# EAGLE design MySens-GWeasySensRS485-V03-062 (EAGLE 9.5.0)
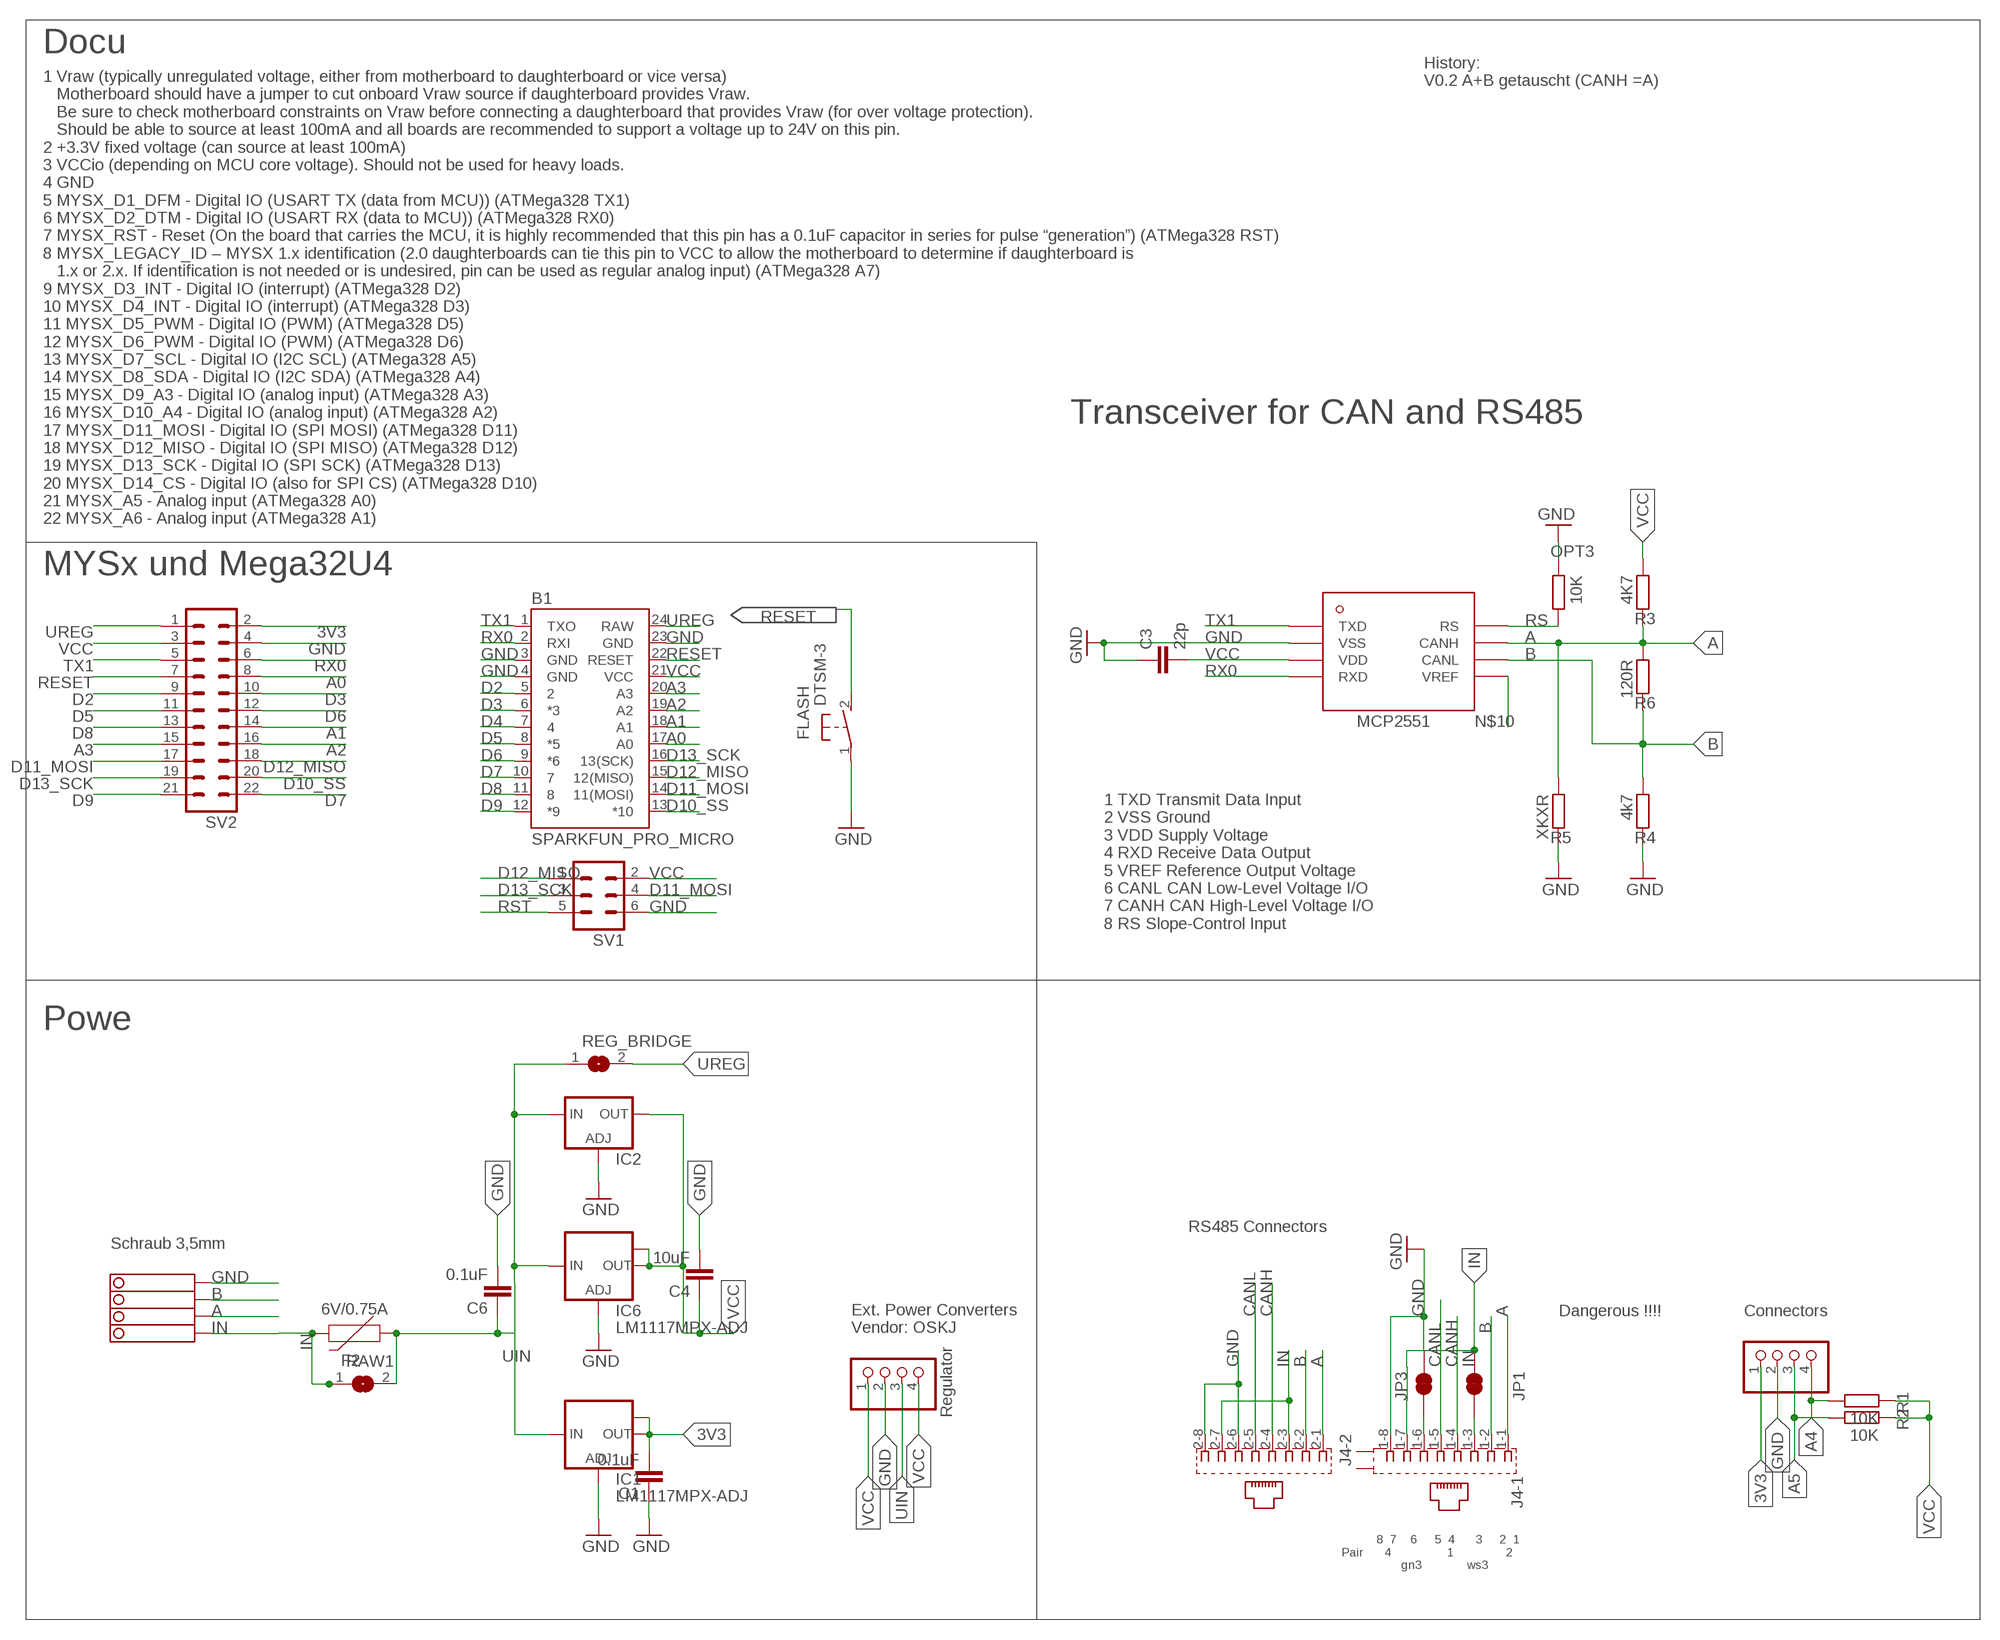
[diagram p0: schematic, sheet 1]

## Parts
B1  SPARKFUN_PRO_MICRO  [SPARKFUN_PRO_MICRO]
C1  0.1uF  C-EUC1206  [C1206]
C3  22p  C-EUC0805  [C0805]
C4  10uF  C-EUC1210  [C1210]
C6  0.1uF  C-EUC1206  [C1206]
F2  6V/0.75A  PPTC_THREE-QUARTER-AMP  [1206]
FLASH  DTSM-3  [DTSM-3]
I2C  PINHD-1X04_2.54-S  [1X04-S]
IC1  LM1117MPX-ADJ  [SOT223]
IC2  LD117ADT50TR  [DPACK]
IC6  LM1117MPX-ADJ  [SOT223]
J4  RJ45_2X_S  [RJ45_2X_S]
JP1  JUMPER-SMT_2_NC_TRACE_SILK  [SMT-JUMPER_2_NC_TRACE_SILK]
JP3  JUMPER-SMT_2_NC_TRACE_SILK  [SMT-JUMPER_2_NC_TRACE_SILK]
OPT3  10K  R-EU_R0805  [R0805]
R1  10K  R-EU_R0805  [R0805]
R2  10K  R-EU_R0805  [R0805]
R3  4K7  R-EU_R0805  [R0805]
R4  4k7  R-EU_R0805  [R0805]
R5  XKXR  R-EU_R0805  [R0805]
R6  120R  R-EU_R0805  [R0805]
RAW1  SJ  [SJ]
REG_BRIDGE  SJ  [SJ]
STEPDWN  PINHD-1X04_2.54-S  [1X04-S]
SV1  MA03-2  [MA03-2]
SV2  MA11-2  [MA11-2]
U$1  MCP2551  [SOIC-8]
X4  1751264  [1751264]

## Nets
1: J4.1-3 JP1.1
2: J4.1-6 JP3.1
3V3: C1.2 I2C.1 IC1.2(OUT) IC1.TAB(OUT1) SV2.2
A: J4.1-1 J4.2-1 R3.2 R5.1 R6.1 U$1.CANH X4.2
A0: B1.17(A0) SV2.8
A1: B1.18(A1) SV2.14
A2: B1.19(A2) SV2.16
A3: B1.20(A3) SV2.15
A4: I2C.4 R1.2
A5: I2C.3 R2.2
B: J4.1-2 J4.2-2 R4.1 R6.2 U$1.CANL X4.3
CANH: J4.1-4 J4.2-4
CANL: J4.1-5 J4.2-5
D2: B1.5 SV2.9
D3: B1.6(*3) SV2.10
D4: B1.7
D5: B1.8(*5) SV2.11
D6: B1.9(*6) SV2.12
D7: B1.10 SV2.22
D8: B1.11 SV2.13
D9: B1.12(*9) SV2.21
D10_SS: B1.13(*10) SV2.20
D11_MOSI: B1.14(11(MOSI)) SV1.4 SV2.17
D12_MISO: B1.15(12(MISO)) SV1.1 SV2.18
D13_SCK: B1.16(13(SCK)) SV1.3 SV2.19
GND [Power]: B1.3(GND) B1.4(GND) B1.23(GND) C1.1 C3.1 C4.2 C6.2 FLASH.1 I2C.2 IC1.1(ADJ) IC2.1(ADJ) IC6.1(ADJ) J4.1-8 J4.2-6 J4.2-8 JP3.2 OPT3.1 R4.2 R5.2 STEPDWN.2 SV1.6 SV2.4 U$1.VSS X4.4
IN [Power]: F2.2 J4.1-7 J4.2-3 J4.2-7 JP1.2 RAW1.1 X4.1
N$10: U$1.VREF
RESET: B1.22(RESET) FLASH.2 SV2.7
RS: OPT3.2 U$1.RS
RST: SV1.5
RX0: B1.2(RXI) SV2.6 U$1.RXD
TX1: B1.1(TXO) SV2.5 U$1.TXD
UIN [Power]: C6.1 F2.1 IC1.3(IN) IC2.3(IN) IC6.3(IN) RAW1.2 REG_BRIDGE.1 STEPDWN.3
UREG [Power]: B1.24(RAW) REG_BRIDGE.2 SV2.1
VCC [Power]: B1.21(VCC) C3.2 C4.1 IC2.4(OUT) IC6.2(OUT) IC6.TAB(OUT1) R1.1 R2.1 R3.1 STEPDWN.1 STEPDWN.4 SV1.2 SV2.3 U$1.VDD
Unconnected: J4.G1(-1:S2) J4.G3(-1:S1)

## Notes on the sheet
- Docu
- History:
  V0.2 A+B getauscht (CANH =A)
- Transceiver for CAN and RS485
- 1 Vraw (typically unregulated voltage, either from motherboard to daughterboard or vice versa)
     Motherboard should have a jumper to cut onboard Vraw source if daughterboard provides Vraw. 
     Be sure to check motherboard constraints on Vraw before connecting a daughterboard that provides Vraw (for over voltage protection). 
     Should be able to source at least 100mA and all boards are recommended to support a voltage up to 24V on this pin.
  2 +3.3V fixed voltage (can source at least 100mA)
  3 VCCio (depending on MCU core voltage). Should not be used for heavy loads.
  4 GND
  5 MYSX_D1_DFM - Digital IO (USART TX (data from MCU)) (ATMega328 TX1)
  6 MYSX_D2_DTM - Digital IO (USART RX (data to MCU)) (ATMega328 RX0)
  7 MYSX_RST - Reset (On the board that carries the MCU, it is highly recommended that this pin has a 0.1uF capacitor in series for pulse “generation”) (ATMega328 RST)
  8 MYSX_LEGACY_ID – MYSX 1.x identification (2.0 daughterboards can tie this pin to VCC to allow the motherboard to determine if daughterboard is 
     1.x or 2.x. If identification is not needed or is undesired, pin can be used as regular analog input) (ATMega328 A7)
  9 MYSX_D3_INT - Digital IO (interrupt) (ATMega328 D2)
  10 MYSX_D4_INT - Digital IO (interrupt) (ATMega328 D3)
  11 MYSX_D5_PWM - Digital IO (PWM) (ATMega328 D5)
  12 MYSX_D6_PWM - Digital IO (PWM) (ATMega328 D6)
  13 MYSX_D7_SCL - Digital IO (I2C SCL) (ATMega328 A5)
  14 MYSX_D8_SDA - Digital IO (I2C SDA) (ATMega328 A4)
  15 MYSX_D9_A3 - Digital IO (analog input) (ATMega328 A3)
  16 MYSX_D10_A4 - Digital IO (analog input) (ATMega328 A2)
  17 MYSX_D11_MOSI - Digital IO (SPI MOSI) (ATMega328 D11)
  18 MYSX_D12_MISO - Digital IO (SPI MISO) (ATMega328 D12)
  19 MYSX_D13_SCK - Digital IO (SPI SCK) (ATMega328 D13)
  20 MYSX_D14_CS - Digital IO (also for SPI CS) (ATMega328 D10)
  21 MYSX_A5 - Analog input (ATMega328 A0)
  22 MYSX_A6 - Analog input (ATMega328 A1)
- MYSx und Mega32U4
- 1 TXD Transmit Data Input 
  2 VSS Ground 
  3 VDD Supply Voltage 
  4 RXD Receive Data Output 
  5 VREF Reference Output Voltage 
  6 CANL CAN Low-Level Voltage I/O 
  7 CANH CAN High-Level Voltage I/O 
  8 RS Slope-Control Input
- Powe
- RS485 Connectors
- Schraub 3,5mm
- Dangerous !!!! | Connectors
- Ext. Power Converters
  Vendor: OSKJ
- Regulator
- 8  7    6     5  4      3     2  1
  Pair      4                1               2
                   gn3             ws3

## Library data of the parts
B1 = SparkFun-Boards:SPARKFUN_PRO_MICRO: SparkFun Pro Micro Atmega32U4 compatible footprint. SparkFun Products: 3.3V/8MHz <https://www.sparkfun.com/products/12587> 5V/16MHz <https://www.sparkfun.com/products/12640>
C1 C3 C4 C6 = rcl:C-EU: CAPACITOR, European symbol
F2 = SparkFun-Fuses:PPTC: Resettable Fuse PPTC Resettable Fuse. Really a sort of resistor with a polymeric positive temperature coefficient whose resistance increases dramatically with an increase in temperature. When heated by the power passing through the resistance rises causing the current to be limited, protecting the circuit. This is achieved by the transition of the polymer from a crystalline to an amorphous state where the conductive carbon separates breaking the conductive pathways found in the cool crystalline structure. When a PPTC cools back down it resumes conducting letting the circuit turn back on. SparkFun Products: SparkFun RedBoard - Programmed with Arduino <https://www.sparkfun.com/products/12757> Pro Micro - 5V/16MHz <https://www.sparkfun.com/products/12640> Arduino Pro 328 - 5V/16MHz <https://www.sparkfun.com/products/10915> MP3 Trigger <https://www.sparkfun.com/products/13720>; PROD_ID: RES-11150
FLASH = mechanics:DTSM-3: Diptronics SMD button 6x3.5 mm
I2C STEPDWN = pinhead-2:PINHD-1X04: PIN HEADER
IC1 IC6 = lm1117:LM1117MPX-ADJ
IC2 = v-reg:LD117A?*: Low drop fixed and adjustable positive voltage regulators 1 A Source: http://www.st.com/stonline/products/literature/ds/7194/ld1117axx.pdf
J4 = RJ45:RJ45_2X_S: AMP connector
JP1 JP3 = SparkFun-Jumpers:JUMPER-SMT_2_NC_TRACE: Normally closed trace jumper This jumper has a trace between two pads so it's normally closed (NC). Use a razor knife to open the connection. For best results follow the IPC guidelines for cutting traces: Cutout at least 0.063 mm (0.005 in). Remove all loose material to clean up the cut area. Seal the cut with an approved epoxy. Reapply solder to reclose the connection.
OPT3 R1-R6 = rcl:R-EU_: RESISTOR, European symbol
RAW1 REG_BRIDGE = jumper:SJ: SMD solder JUMPER
SV1 = con-lstb:MA03-2: PIN HEADER; OC_FARNELL: unknown; OC_NEWARK: unknown
SV2 = con-Pinheader:MA11-2: PIN HEADER; OC_FARNELL: unknown; OC_NEWARK: unknown
U$1 = MCP2551:MCP2551: The MCP2551 is a high-speed CAN, fault-tolerant device that serves as the interface between a CAN protocol controller and the physical bus. The MCP2551 provides differential transmit and receive capability for the CAN protocol controller and is fully compatible with the ISO-11898 standard, including 24V requirements. It will operate at speeds of up to 1 Mb/s. Typically, each node in a CAN system must have a device to convert the digital signals generated by a CAN controller to signals suitable for transmission over the bus cabling (differential output). It also provides a buffer between the CAN controller and the high-voltage spikes that can be generated on the CAN bus by outside sources (EMI, ESD, electrical transients, etc.).
X4 = con-phoenix-350:1751264: MKDS 1/ 4-3,5 Printklemme Nennstrom: 10 A Bemessungsspannung: 160 V Raster: 3,5 mm Polzahl: 4 Montageart: Löten Anschlussart: Schraubanschluss Anschlussrichtung vom Leiter zur Platine: 0° Source: http://eshop.phoenixcontact.com .. 1751264.pdf; MPN: 1751264; OC_FARNELL: unknown; OC_NEWARK: 10R0934

## Net classes
0 default: width 0.254 mm
1 Power: width 0.508 mm

## Board
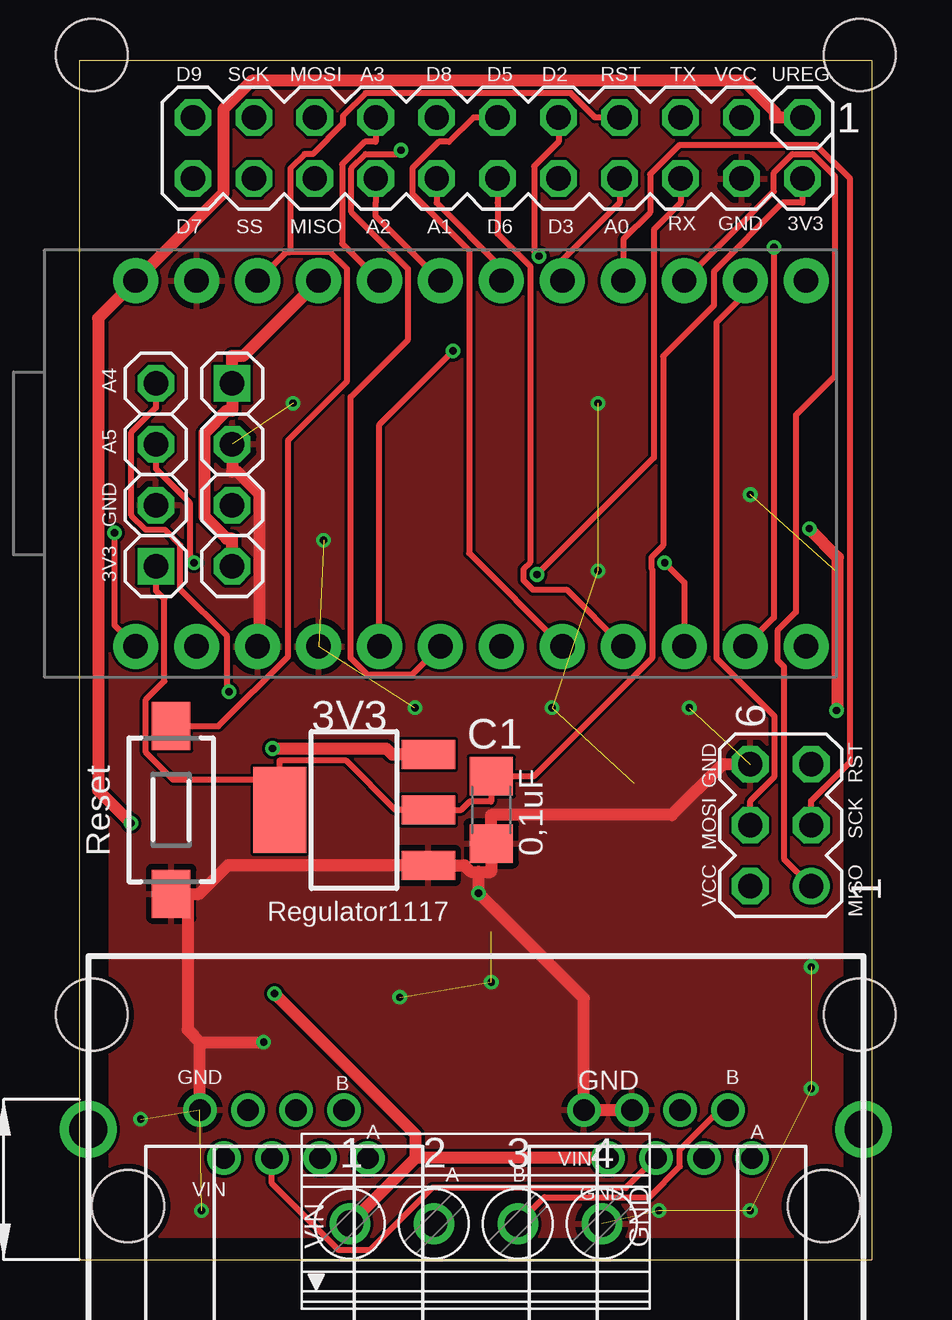
[diagram p1: board, top side]
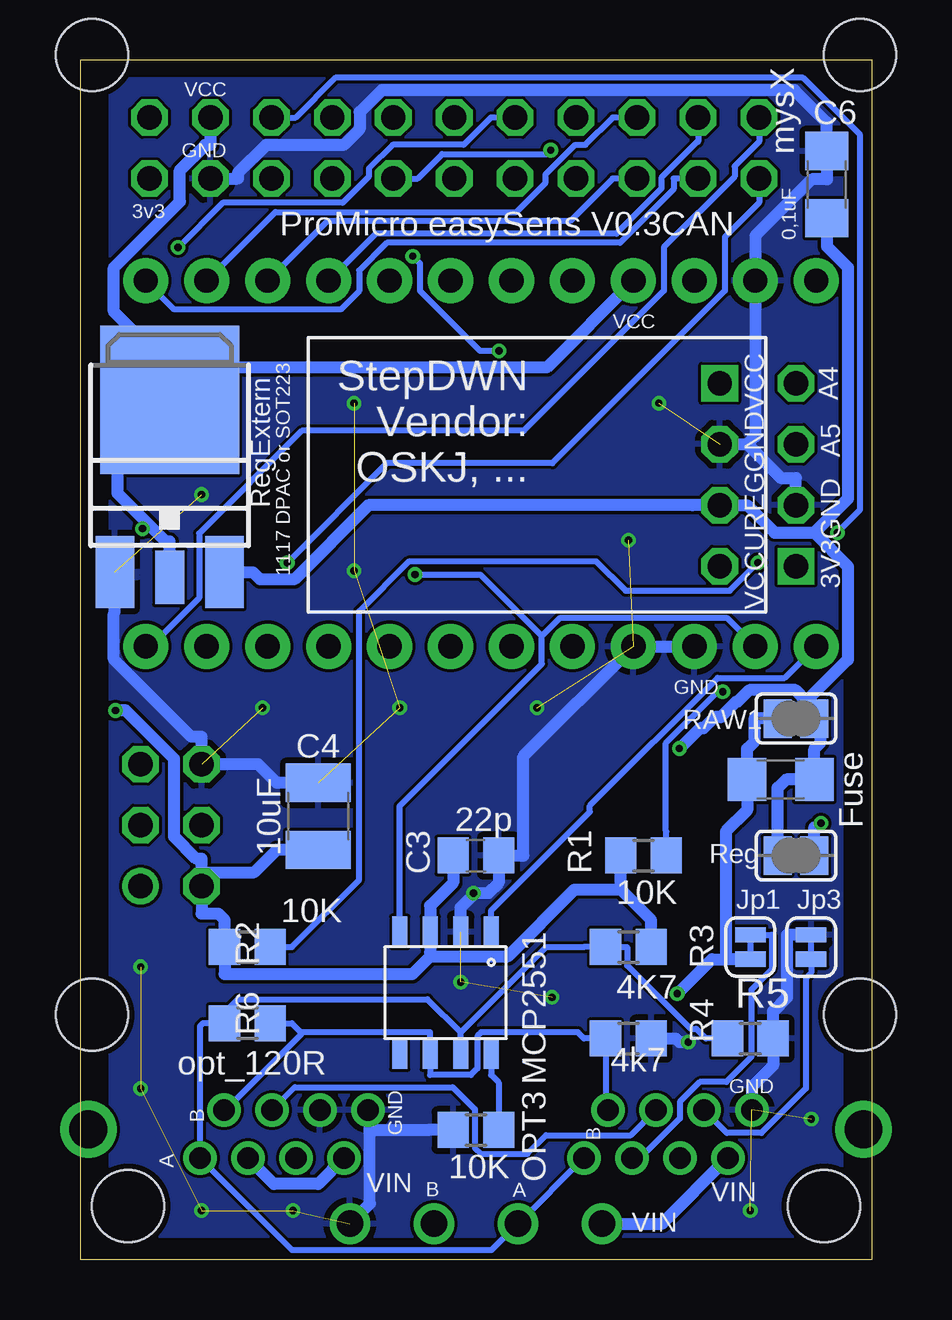
[diagram p2: board, bottom side, seen from below]

Size 33 x 50 mm. Coordinates in mm from the lower left corner, seen from the top.
Outline: 0,0 0,50 33,50 33,0 0,0
Copper layers (1*16): Top 0.035mm / dielectric 1.5mm / Bottom 0.035mm
Design rules "dirt_cheap_dirty_boards.v1": minimum track width 5mil, minimum drill 12mil, track to track 5mil, track to pad 5mil, pad to pad 5mil, via to via 5mil, smd to smd 0mil, copper to edge 10mil, drill to drill 10mil, minimum pad ring 10mil, minimum via ring 6mil, stop-mask expansion 2mil, vias tented up to drill 25mil, thermal gap 10mil
Holes 3 mm at 32.5,50.2 0.5,50.2 32.5,10.2 0.5,10.2
tRestrict: area 0,50 to 33,50.5; area 32.8,11.9 to 33.3,44.9
bRestrict: area 0,50 to 33,50.5; area 32.8,12 to 33.3,45

### Footprints (pad centres in the part's own frame; a part is rotated, then mirrored left to right if it is on the bottom)
SPARKFUN_PRO_MICRO = drill 1.016 pad 1.88: 1 -7.62,12.7; 2 -7.62,10.16; 3 -7.62,7.62; 4 -7.62,5.08; 5 -7.62,2.54; 6 -7.62,0; 7 -7.62,-2.54; 8 -7.62,-5.08; 9 -7.62,-7.62; 10 -7.62,-10.16; 11 -7.62,-12.7; 12 -7.62,-15.24; 13 7.62,-15.24; 14 7.62,-12.7; 15 7.62,-10.16; 16 7.62,-7.62; 17 7.62,-5.08; 18 7.62,-2.54; 19 7.62,0; 20 7.62,2.54; 21 7.62,5.08; 22 7.62,7.62; 23 7.62,10.16; 24 7.62,12.7
C1206 = smd 1.6 x 1.8: 1 -1.4,0; 2 1.4,0
C0805 = smd 1.3 x 1.5: 1 -0.95,0; 2 0.95,0
C1210 = smd 1.6 x 2.7: 1 -1.4,0; 2 1.4,0
1206 = smd 1.6 x 1.8: 1 -1.4,0; 2 1.4,0
DTSM-3 = smd 2 x 1.6: 1 -3.494,0; 2 3.494,0
1X04-S = drill 1.016 square: 1 -3.81,0 | drill 1.016 octagon: 2 -1.27,0; 3 1.27,0; 4 3.81,0
SOT223 = smd 1.219 x 2.235: 1 -2.311,-3.099; 2 0,-3.099; 3 2.311,-3.099 | smd 3.6 x 2.2: TAB 0,3.099
DPACK = smd 1.6 x 3: 1 -2.28,-4.8; 3 2.28,-4.8 | smd 5.8 x 6.2: 4 0,2.38
RJ45_2X_S = drill 0.889: 1-1 -4.5,2; 1-2 -5.5,4; 1-3 -6.5,2; 1-4 -7.5,4; 1-5 -8.5,2; 1-6 -9.5,4; 1-7 -10.5,2; 1-8 -11.5,4; 2-1 11.5,2; 2-2 10.5,4; 2-3 9.5,2; 2-4 8.5,4; 2-5 7.5,2; 2-6 6.5,4; 2-7 5.5,2; 2-8 4.5,4 | drill 1.575 pad 2.184: G1 -16.15,3.2; G3 16.15,3.2 | hole 3: -14.5,0; 14.5,0
SMT-JUMPER_2_NC_TRACE_SILK = smd 0.635 x 1.27: 1 -0.508,0; 2 0.508,0
R0805 = smd 1.3 x 1.5: 1 -0.95,0; 2 0.95,0
SJ = smd 1.168 x 1.6: 1 -0.762,0; 2 0.762,0
MA03-2 = drill 1.016: 1 -2.54,-1.27 | drill 1.016 octagon: 2 -2.54,1.27; 3 0,-1.27; 4 0,1.27; 5 2.54,-1.27; 6 2.54,1.27
MA11-2 = drill 1.016 octagon: 1 -12.7,-1.27; 2 -12.7,1.27; 3 -10.16,-1.27; 4 -10.16,1.27; 5 -7.62,-1.27; 6 -7.62,1.27; 7 -5.08,-1.27; 8 -5.08,1.27; 9 -2.54,-1.27; 10 -2.54,1.27; 11 0,-1.27; 12 0,1.27; 13 2.54,-1.27; 14 2.54,1.27; 15 5.08,-1.27; 16 5.08,1.27; 17 7.62,-1.27; 18 7.62,1.27; 19 10.16,-1.27; 20 10.16,1.27; 21 12.7,-1.27; 22 12.7,1.27
SOIC-8 = smd 1.27 x 0.635: CANH 2.54,0.635; CANL 2.54,-0.635; RS 2.54,1.905; RXD -2.54,-1.905; TXD -2.54,1.905; VDD -2.54,-0.635; VREF 2.54,-1.905; VSS -2.54,0.635
1751264 = drill 1.1 pad 1.7: 1 -5.25,-0.1; 2 -1.75,-0.1; 3 1.75,-0.1; 4 5.25,-0.1

### Placement (x,y rotation side)
B1  15.03,33.18 90 top
C1  17.14,18.74 90 top
C3  16.51,16.84 180 bottom
C4  23.08,18.48 90 bottom
C6  1.89,44.81 90 bottom
F2  3.81,20.01 180 bottom
FLASH  3.81,18.74 90 top
I2C  3.17,32.71 90 top
IC1  11.43,18.74 90 top
IC2  29.27,33.46 0 bottom
IC6  29.27,31.53 0 bottom
J4  16.51,2.23 0 top
JP1  5.08,13.03 270 bottom
JP3  2.54,13.03 90 bottom
OPT3  16.51,5.41 0 bottom
R1  9.53,16.84 0 bottom
R2  26.04,13.03 0 bottom
R3  10.16,13.03 180 bottom
R4  10.16,9.21 0 bottom
R5  5.08,9.21 0 bottom
R6  26.04,9.85 0 bottom
RAW1  3.17,22.55 0 bottom
REG_BRIDGE  3.17,16.84 0 bottom
STEPDWN  6.35,32.71 270 top
SV1  29.21,18.11 90 top
SV2  17.41,46.33 180 top
U$1  17.78,11.12 270 bottom
X4  16.51,1.6 0 top

### Tracks (layer width: path | path; a pad name or v marks a point on that pad's centre or on a via)
1
  Bottom 0.254: JP1.1 4.19,13.53 4.19,12.09 5.03,11.25 5.03,8.45 6.08,7.41 7.18,7.41 8.01,6.58 8.01,5.88 9.66,4.23 J4.1-3
2
  Bottom 0.254: JP3.1 2.54,11.95 2.76,11.72 2.76,7.13 4.62,5.27 6.05,5.27 J4.1-6
3V3
  Top 0.254: SV2.2 30.11,44.04 29.28,44.04 26.42,41.19 26.42,39.76 24.31,37.65 24.31,29.77 23.82,29.27 23.82,28.8 23.85,28.77 23.85,25.06 18.93,20.14 C1.2 17.14,19.09 16.25,19.09 15.9,18.74 IC1.2 13.16,18.74 11.1,20.79 8.33,20.79 8.33,19.99 | I2C.1 3.17,27.88 3.53,27.53 3.53,24.11 2.76,23.34 2.76,21.13 3.89,19.99 8.33,19.99 | IC1.TAB 8.33,19.99
A
  Bottom 0.254: J4.1-1 14.74,1.5 X4.2 15.87,0.39 24.17,0.39 J4.2-1 28.01,9.73 27.89,9.85 27.44,9.85 | R5.1 6.93,9.21 7.33,9.62 7.56,9.62 10.21,12.26 10.21,13.03 R3.2 12.01,13.03 13.59,13.03 17.14,9.47 | 27.44,9.85 26.43,10.85 18.53,10.85 17.14,9.47 | R6.1 27.44,9.85 | U$1.CANH 17.14,9.47
A0
  Top 0.254: SV2.8 22.5,44.04 20.11,41.66 B1.17
A1
  Top 0.254: SV2.14 14.88,44.04 17.57,41.35 B1.18
A2
  Top 0.254: B1.19 12.34,43.49 12.34,44.04 SV2.16
A3
  Top 0.254: SV2.15 12.34,46.58 11.88,46.58 10.94,45.65 10.94,42.35 B1.20
A4  (via drill 0.3 pad 0.61)
  Top 0.254: v6.23,23.67 6.14,23.75 6.14,25.98 4.2,27.92 4.2,29.76 3.55,30.41 2.76,30.41 2.16,31.01 2.16,34.49 3.17,35.5 I2C.4
  Bottom 0.254: v6.23,23.67 6.46,23.67 8.6,21.53 8.6,17.86 8.57,17.84 R1.2
A5  (via drill 0.3 pad 0.61)
  Top 0.254: v4.76,29.05 4.58,29.23 4.58,31.56 3.17,32.96 I2C.3
  Bottom 0.254: v4.76,29.05 5.93,27.88 10.28,27.88 11.51,29.11 19.28,29.11 21.38,27.01 21.38,15.83 24.18,13.03 R2.2
B
  Top 0.254: X4.3 19.36,2.6 23.73,2.6 25.01,3.88 25.01,4.58 26.66,6.23 J4.2-2
  Bottom 0.254: J4.1-2 11.11,6.33 R4.1 12.01,9.21 12.27,9.47 16.3,9.47 16.45,9.32 16.45,7.96 16.72,7.69 18.41,7.69 U$1.CANL 18.41,8.93 18.41,9.47 23.8,9.47 | 23.8,9.47 24.18,9.85 R6.2 | 23.8,9.47 23.8,9.37 26.94,6.23 J4.2-2
CANH
  Bottom 0.254: J4.2-4 24.06,7.18 17.48,7.18 16.56,6.26 16.56,4.64 16.32,4.4 14.37,4.4 13.59,5.18 10.06,5.18 J4.1-4
CANL
  Top 0.254: J4.2-5 22.76,2.98 14.68,2.98 12.09,0.39 10.8,0.39 8.01,3.18 J4.1-5
D2  (via drill 0.3 pad 0.61)
  Top 0.254: v19.14,41.82 18.94,42.03 18.94,45.57 19.95,46.58 SV2.9 | B1.5 12.49,34.81 v15.55,37.87
  Bottom 0.254: v15.55,37.87 16.34,37.87 18.84,40.37 18.84,41.52 v19.14,41.82
D3  (via drill 0.3 pad 0.61)
  Top 0.254: B1.6 13.84,24.37 11.99,24.37 11.29,25.07 11.29,35.96 13.69,38.35 13.69,41.29 11.32,43.66 11.32,45.48 11.91,46.08 13.23,46.08 v13.39,46.24
  Bottom 0.254: v13.39,46.24 13.55,46.08 17.92,46.08 18.94,45.06 SV2.10
D5
  Top 0.254: B1.8 16.23,29.44 16.23,42.06 13.86,44.42 13.86,45.48 14.96,46.58 15.38,46.58 16.4,47.6 SV2.11
D6
  Top 0.254: B1.9 20.29,27.92 18.89,27.92 18.48,28.32 18.48,28.78 18.76,29.06 18.76,41.41 17.41,42.76 17.41,44.04 SV2.12
D7  (via drill 0.3 pad 0.61)
  Top 0.254: v24.37,29.04 25.19,28.22 B1.10
  Bottom 0.254: SV2.22 4.71,44.04 6.14,42.62 6.14,40.38 13.32,33.19 20.22,33.19 v24.37,29.04
D8  (via drill 0.3 pad 0.61)
  Top 0.254: v28.92,42.18 28.92,26.75 B1.11
  Bottom 0.254: v28.92,42.18 27.06,44.04 22.07,44.04 20.97,45.14 20.97,45.48 19.98,46.47 17.02,46.47 15.89,47.6 SV2.13
D9
  Bottom 0.254: SV2.21 4.71,46.58 5.73,45.57 5.73,45.14 8.68,42.19 8.68,40.38 14.51,34.55 23.76,34.55 28.05,30.26 28.05,27.57 30.05,25.56 B1.12
D10_SS
  Bottom 0.254: B1.13 29.07,39.6 22.15,39.6 21.38,40.38 21.38,41.22 20.22,42.38 10.5,42.38 8.27,44.61 8.27,45.06 SV2.20
D11_MOSI
  Top 0.254: B1.14 27.73,40.26 26.54,39.07 26.54,25.06 28.96,22.64 28.96,20.14 27.94,19.12 SV1.4
  Bottom 0.254: SV2.17 10.81,47.6 11.95,46.47 12.37,46.47 13.61,45.23 13.61,44.89 14.83,43.66 24.87,43.66 B1.14
D12_MISO
  Top 0.254: B1.15 28.92,44.53 28.92,45.3 29.69,46.08 30.54,46.08 31.46,45.15 31.46,36.83 29.84,35.21 29.84,26.98 29.07,26.21 29.07,24.98 29.34,24.71 29.34,16.7 SV1.1
  Bottom 0.254: SV2.18 10.81,45.06 12.59,43.28 22.71,43.28 B1.15
D13_SCK
  Top 0.254: B1.16 22.65,42.52 23.77,43.64 23.77,45.23 24.99,46.46 30.7,46.46 32.1,45.05 32.1,20.74 30.48,19.12 SV1.3
  Bottom 0.254: B1.16 20.69,42.76 10.66,42.76 8.78,44.64 8.78,45.09 7.29,46.58 7.25,46.58 SV2.19
GND  (via drill 0.3 pad 0.61)  (16 unrouted)
  Top 0.508: SV1.6 26.8,20.64 24.67,18.52 17.14,18.52 C1.1 17.14,16.16 16.61,16.16 | 16.61,16.16 16.3,16.16 16.03,16.43 IC1.1 6.17,16.43 4.99,15.25 4.49,15.25 | 16.61,16.16 v16.61,15.28 21.01,10.88 J4.2-8 J4.2-6 | STEPDWN.2 6.35,32.84 6.57,32.84 7.49,31.92 7.49,25.64 B1.3 | 5.01,9.06 v7.67,9.06 | 4.49,15.25 4.49,9.57 5.01,9.06 | J4.1-8 5.01,9.06 | FLASH.1 4.49,15.25
  Bottom 0.508: 5.21,33.98 4.87,34.32 B1.23 4.87,42.67 2.52,45.02 1.89,45.02 C6.2 1.89,47.39 3.25,48.74 20.43,48.74 21.35,47.83 21.35,47.12 22.02,46.46 25.26,46.46 26.43,45.28 26.43,45.06 SV2.4 | I2C.2 3.17,32.58 3.81,32.58 5.21,33.98 | STEPDWN.2 5.21,33.98 | B1.3 B1.4 14.53,20.98 14.53,16.84 C3.1 15.56,15.7 15.99,15.28 v16.61,15.28 16.61,15.21 17.14,14.68 U$1.VSS | R4.2 8.18,9.21 8.02,9.06 v7.67,9.06 | J4.1-8 5.01,7.2 4.13,8.08 R5.2 4.13,10.35 3.56,10.92 3.56,13.53 JP3.2 | 20.93,5.41 20.93,6.15 J4.2-8 | X4.4 20.93,2.33 20.93,5.41 | 20.93,5.41 18.49,5.41 OPT3.1 | IC2.1 31.55,28.47 IC6.1 31.58,26.94 31.59,26.93 31.59,25.01 28.37,21.79 27.94,21.79 SV1.6 25.58,20.64 24.81,19.88 C4.2
  other vias: 8.89,35.7 10.16,29.98 21.59,28.71 21.59,35.7 27.94,31.88 25.4,23 19.68,23 13.97,23 24.13,2.04 27.94,2.04 30.48,7.12 30.48,12.2 5.08,2.04 2.54,5.85 13.34,10.93 17.14,11.56
  pour Bottom: 1.27,49.22 31.75,49.22 31.75,0.96 1.27,0.96
  pour Top: 1.27,0.96 1.27,49.22 31.75,49.22 31.75,0.96
IN  (via drill 0.3 pad 0.61)
  Top 0.508: 13.99,4.23 X4.1 | J4.2-7 13.99,4.23 | 13.99,4.23 13.99,5.2 v8.12,11.08
  Bottom 0.508: J4.2-7 23.09,3.15 24.93,3.15 J4.2-3 | 6.1,12.52 6.1,17.84 5.21,18.73 F2.2 5.21,20.44 5.21,21.29 4.9,21.6 4.9,22.55 RAW1.1 | v8.12,11.08 6.68,12.52 6.1,12.52 | JP1.2 6.1,12.52 | X4.1 8.74,1.5 J4.1-7
RESET
  Top 0.254: 8.78,42 10.44,42 11.14,41.29 11.14,36.62 8.68,34.15 8.68,25.14 5.78,22.23 4.86,22.23 FLASH.2 | B1.22 8.61,42 8.78,42 | 8.78,42 8.78,45.49 9.37,46.08 9.71,46.08 10.97,47.33 10.97,47.67 11.91,48.62 20.46,48.62 21.48,47.6 SV2.7
RS
  Bottom 0.254: U$1.RS 15.88,7.69 15.56,7.38 OPT3.2
RX0  (via drill 0.3 pad 0.61)
  Top 0.254: SV2.6 25.04,44.04 23.92,42.93 23.92,33.42 v19.05,28.55
  Bottom 0.254: 13.76,25.98 12.99,26.76 6.07,26.76 B1.2 | U$1.RXD 19.68,18.9 13.76,24.82 13.76,25.98 | v19.05,28.55 16.33,28.55 13.76,25.98
TX1  (via drill 0.3 pad 0.61)
  Top 0.254: B1.1 1.45,26.44 v1.45,30.3
  Bottom 0.254: U$1.TXD 15.88,14.55 11.76,18.66 11.76,18.92 6.44,24.24 3.65,24.24 B1.1 | SV2.5 24.02,47.6 22.37,49.25 2.88,49.25 0.5,46.88 0.5,31.25 v1.45,30.3
UIN  (via drill 0.3 pad 0.61)
  Top 0.508: v8.04,21.3 12.78,21.3 13.03,21.05 IC1.3
  Bottom 0.508: 2.74,23.28 3.19,23.73 5.12,23.73 5.6,23.25 5.67,23.25 6.31,22.61 6.56,22.61 7.02,22.15 7.16,22.15 8.01,21.3 v8.04,21.3 | 2.42,30.3 4.06,30.3 5.21,31.44 STEPDWN.3 7.49,31.44 21,31.44 24.09,28.35 25.51,28.35 25.81,28.66 IC2.3 26.99,28.47 IC6.3 | REG_BRIDGE.1 3.94,19.66 3.59,20.01 F2.1 2.41,21.29 2.17,21.53 2.17,22.55 | 2.74,23.28 2.17,22.71 2.17,22.55 | 2.42,30.3 1.01,28.88 1.01,25.01 2.74,23.28 | 2.42,30.3 1.01,31.71 1.01,41.36 1.88,42.23 1.89,42.23 C6.1 | RAW1.2 2.17,22.55
UREG  (via drill 0.3 pad 0.61)
  Top 0.508: SV2.1 28.97,47.6 28.97,47.82 27.67,49.13 7.17,49.13 5.99,47.95 5.99,44.45 B1.24 0.77,39.24 0.77,19.56 v2.13,18.19
  Bottom 0.508: v2.13,18.19 2.31,18.02 2.41,18.02 REG_BRIDGE.2
VCC  (via drill 0.3 pad 0.61)
  Top 0.508: STEPDWN.4 6.35,30.04 6.13,30.04 5.21,30.96 5.21,34.46 6.13,35.38 6.35,35.38 STEPDWN.1 6.35,37.66 6.81,37.66 B1.21 | v31.53,22.89 31.59,22.96 31.59,29.27 v30.4,30.46
  Bottom 0.508: 18.41,12.64 19.16,11.89 26.98,11.89 R2.1 26.98,14.16 27.25,14.42 27.94,14.42 SV1.2 27.94,16.14 | 18.41,12.64 18.41,12.8 U$1.VDD 18.41,14.75 17.46,15.7 C3.2 | C4.1 24.81,17.07 25.75,16.14 27.94,16.14 | 27.94,16.14 27.94,16.71 28.16,16.71 29.08,17.63 29.08,20.87 31.1,22.89 v31.53,22.89 | 10.47,15.42 R1.1 | 10.47,15.42 9.21,14.16 R3.1 | 18.41,12.64 15.17,12.64 12.39,15.42 10.47,15.42 | 29.27,37.18 31.59,39.51 31.59,41.35 28.84,44.1 28.84,45.41 27.8,46.46 27.57,46.46 SV2.3 | 29.27,37.18 IC2.4 IC6.TAB 31.45,34.63 31.45,31.95 30.19,30.68 | B1.21 13.57,37.18 29.27,37.18 | 30.19,30.68 v30.4,30.46 | 30.19,30.68 29.44,29.93 29.27,29.93 IC6.2

### Text on the board
tNames: D9 | SCK | MOSI | A3 | D8 | D5 | D2 | RST | TX | VCC | UREG | D7 | SS | MISO | A2 | A1 | D6 | D3 | A0 | RX | GND | 3V3 | A4 | A5 | GND | 3V3 | 3V3 | C1 | GND | RST | MOSI | SCK | Reset | 0,1uF | VCC | MISO | Regulator1117 | GND | B | GND | B | A | A | VIN | VIN | A | B | GND | VIN | GND
bNames: VCC | C6 | mysX | GND | 3v3 | ProMicro easySens V0.3CAN | 0,1uF | VCC | VCC | StepDWN / Vendor: / OSKJ, ... | RegExtern | A4 | GND | A5 | GND | UREG | 3V3 | VCC | 1117 DPAC or SOT223 | GND | RAW1 | C4 | 22p | Fuse | Reg | R1 | C3 | 10uF | Jp3 | Jp1 | 10K | 10K | R3 | R2 | 4K7 | R4 | R6 | 4k7 | GND | opt_120R | GND | B | B | 10K | A | VIN | OPT3 | B | VIN | A | VIN
tValues: C6 | 0,1uF | JP-Fuse | C4 | Fuse | 0,1uF | C3 | R1 | 22p | R3 | RJ45 Connector | Opt.120R | 4K7 | OPT3